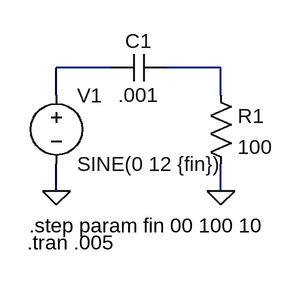
[diagram p0: schematic DC_blocking_sim.asc]
DC_blocking_sim.asc, the LTspice schematic file:
Version 4
SHEET 1 880 680
WIRE 112 112 48 112
WIRE 240 112 176 112
WIRE 48 144 48 112
WIRE 240 144 240 112
WIRE 48 256 48 224
WIRE 240 256 240 224
FLAG 240 256 0
FLAG 48 256 0
SYMBOL cap 176 96 R90
WINDOW 0 0 32 VBottom 2
WINDOW 3 32 32 VTop 2
SYMATTR InstName C1
SYMATTR Value .001
SYMBOL res 224 128 R0
SYMATTR InstName R1
SYMATTR Value 100
SYMBOL voltage 48 128 R0
WINDOW 123 0 0 Left 2
WINDOW 39 0 0 Left 2
SYMATTR InstName V1
SYMATTR Value SINE(0 12 {fin})
TEXT 16 296 Left 2 !.step param fin 00 100 10
TEXT 14 316 Left 2 !.tran .005

The netlist it stands for:
* DC_blocking_sim.asc
C1 N002 N001 .001
R1 N002 0 100
V1 N001 0 SINE(0 12 {fin})
.step param fin 00 100 10
.tran .005
.backanno
.end